# Altium project PCB_Project.PrjPcb
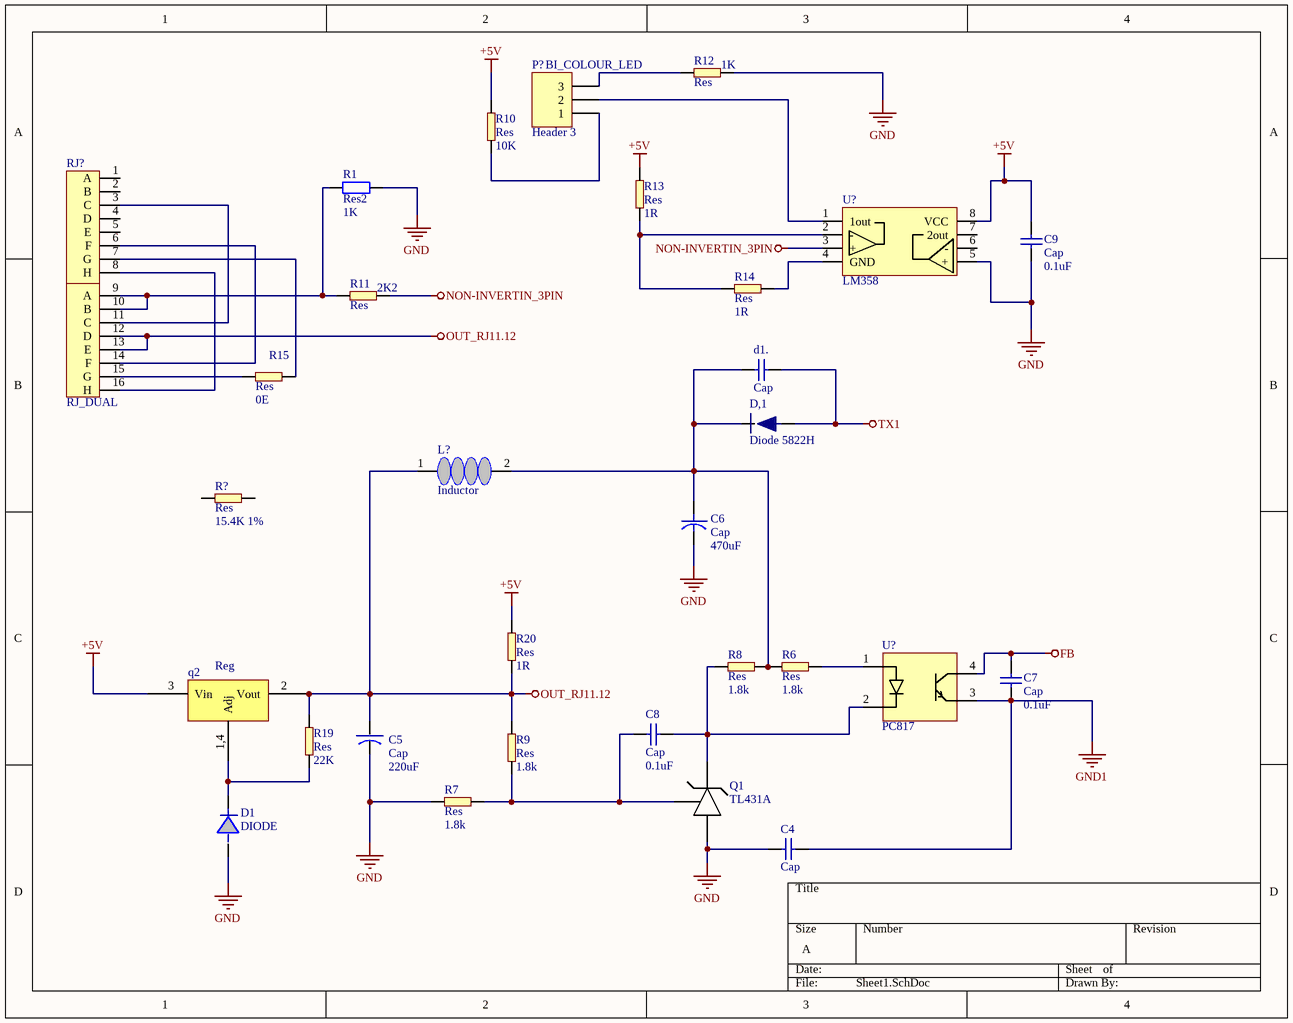
[diagram p0: Sheet1.SchDoc]
2 sheets, 49 parts. Net scope: global (net labels, ports and power ports of the same name join across sheets).
Board file: PCB1.PcbDoc
Sheets:
  Sheet1.SchDoc
  Sheet2.SchDoc

## Sheet Sheet1.SchDoc
size A

### Parts
(Parts that share a designator on the sheet are numbered #1, #2 ... from top to bottom, then left to right.)
C4  Cap  [CAP_P]
C5  Cap  [CAP_220uF]
C6  Cap  [CAP_470uF]
C7  Cap  [RES0805]
C8  Cap  [RES0805]
C9  Cap  [RES0805]
D1  DIODE  [SOD-80]
d1.  Cap  [CAP_P]
D,1  Diode 5822H  [Diode]
L?  Inductor  [Inductor]
P?  Header 3  [HDR1X3]
Q1  TL431A  [TL431A]
q2  Reg  [LM1117]
R1  Res2  value 1K  [AXIAL-0.4]
R6  Res  value 1.8k  [RES0805]
R7  Res  value 1.8k  [RES0805]
R8  Res  value 1.8k  [RES0805]
R9  Res  value 1.8k  [RES0805]
R10  Res  value 10K  [RES0805]
R11  Res  value 2K2  [RES0805]
R12  Res  value 1K  [RES0805]
R13  Res  value 1R  [RES0805]
R14  Res  value 1R  [RES0805]
R15  Res  value 0E  [RES0805]
R19  Res  value 22K  [RES0805]
R20  Res  value 1R  [RES0805]
R?  Res  value 15.4K 1%  [RES0805]
RJ?  RJ_DUAL  [RJ_Dual]
U?#1  LM358  [SOIC_8pin]
U?#2  PC817  [PC817]

### Nets
+5V: C9.2(A) q2.3(Vin) R10.1(a) R13.2(b) R20.1(a) U?#1.8(VCC)
FB: C7.1(A) U?#2.4(E)
GND: C4.2(A) C5.2(b) C6.2(b) C9.1(A) D1.1(A) Q1.2 R1.2 R7.2(b) R12.1(a) U?#1.5(+)
GND1: C4.1(A) C7.2(A) U?#2.3(D)
NON-INVERTIN_3PIN: R11.1(a) U?#1.3(+)
OUT_RJ11.12: C5.1(a) L?.1(a) q2.2(Vout) R9.1(a) R19.1(a) R20.2(b) RJ?.12(D) RJ?.13(E)
TX1: d1..1(A) D,1.1
NetC6_1: C6.1(A) d1..2(A) D,1.2 L?.2(b) R6.2(b) R8.1(a)
NetC8_1: C8.1(A) Q1.3 R8.2(b) U?#2.2(B)
NetC8_2: C8.2(A) Q1.1 R7.1(a) R9.2(b)
NetD1_2: D1.2(B) q2.1,4(Adj) R19.2(b)
NetP?_1: P?.1 R10.2(b)
NetP?_2: P?.2 U?#1.1(1out)
NetP?_3: P?.3 R12.2(b)
NetR1_1: R1.1 R11.2(b) RJ?.9(A) RJ?.10(B)
NetR6_1: R6.1(a) U?#2.1(A)
NetR13_1: R13.1(a) R14.2(b) U?#1.2(-)
NetR14_1: R14.1(a) U?#1.4(GND)
NetR15_1: R15.1(a) RJ?.15(G)
NetR15_2: R15.2(b) RJ?.7(G)
NetRJ?_3: RJ?.3(C) RJ?.11(C)
NetRJ?_6: RJ?.6(F) RJ?.14(F)
NetRJ?_8: RJ?.8(H) RJ?.16(H)

Not connected (* = marked no-connect by the designer): R? 1(a) 2(b); RJ? 1(A) 2(B) 4(D) 5(E); U?#1 6(-) 7(2out)

### Notes on the sheet
- (near P?) BI_COLOUR_LED
- (in symbol CAP_104_SMD) 0.1uF
- (in symbol CAP_220uF) 220uF
- (in symbol CAP_470uF) 470uF

### Library data of the parts
C4 d1. = Capacitor
C5 = CAP_220uF
C6 = CAP_470uF
C7-C9 = CAP_104_SMD
D1 = DIODE_4148: HIGH SPEED DIODE
L? = Inductor: Inductor for TSOP
P? = Header 3: Header, 3-Pin; LatestRevisionDate: 17-Jul-2002; LatestRevisionNote: Re-released for DXP Platform.; Publisher: Altium Limited
Q1 = TL431A_Adjustable Zener
q2 = LM1117
R1 = Res2: Resistor; Published: 8-Jun-2000; LatestRevisionDate: 17-Jul-2002; LatestRevisionNote: Re-released for DXP Platform.; PackageReference: AXIAL-0.4; Publisher: Altium Limited; PackageDescription: Axial Device, Thru-Hole; 2 Leads; 0.4 in Pin Spacing
R6-R15 R19 R20 R? = Resistor: Res0805
U?#1 = LM358: Dule op-Amp
U?#2 = PC817: Opto coupler

## Sheet Sheet2.SchDoc
size A
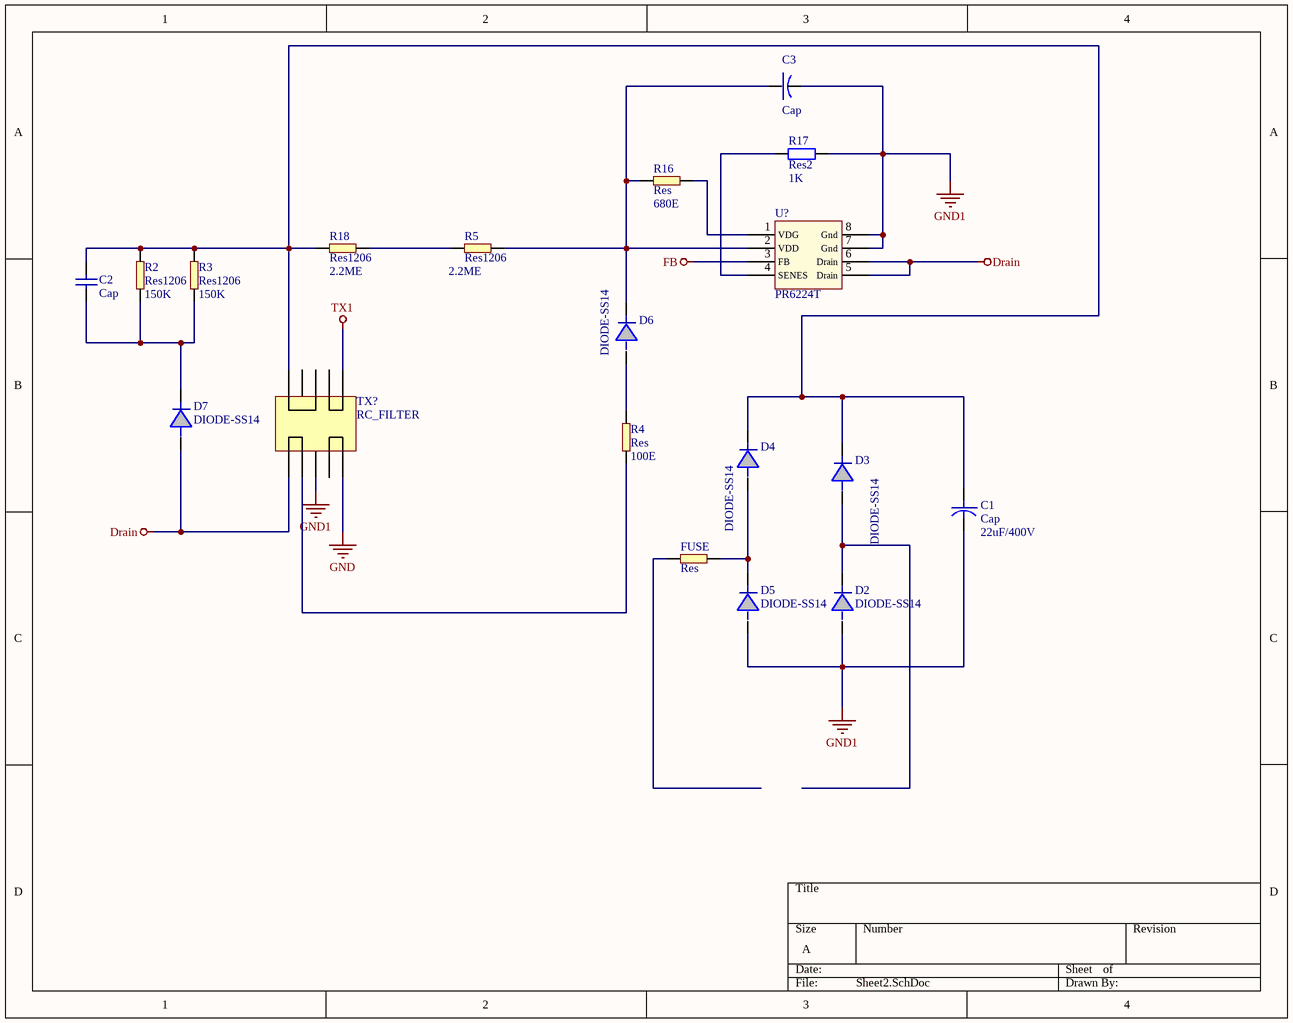
[diagram p1: Sheet2.SchDoc]

### Parts
(Parts that share a designator on the sheet are numbered #1, #2 ... from top to bottom, then left to right.)
C1  Cap  [CAP_470uF]
C2  Cap  [CAP_P]
C3  Cap  [Capacitor10UF/63V]
D2  DIODE-SS14  [DO-214AC]
D3  DIODE-SS14  [DO-214AC]
D4  DIODE-SS14  [DO-214AC]
D5  DIODE-SS14  [DO-214AC]
D6  DIODE-SS14  [DO-214AC]
D7  DIODE-SS14  [DO-214AC]
FUSE  Res  [Res_150mil]
R2  Res1206  value 150K  [1206]
R3  Res1206  value 150K  [1206]
R4  Res  value 100E  [RES0805]
R5  Res1206  value 2.2ME  [1206]
R16  Res  value 680E  [RES0805]
R17  Res2  value 1K  [AXIAL-0.4]
R18  Res1206  value 2.2ME  [1206]
TX?  RC_FILTER  [RC_FILTER]
U?#3  PR6224T  [PR6224T]

### Nets
Drain: D7.1(A) TX?.6 U?#3.5(Drain) U?#3.6(Drain)
FB: U?#3.3(FB)
GND: TX?.10
GND1: C1.2(b) C3.2(b) D2.1(A) D5.1(A) R17.2 TX?.8 U?#3.7(Gnd) U?#3.8(Gnd)
TX1: TX?.1
NetC1_1: C1.1(A) C2.2(A) D3.2(B) D4.2(B) R2.2(b) R3.2(b) R18.2(b) TX?.5
NetC2_1: C2.1(A) D7.2(B) R2.1(a) R3.1(a)
NetC3_1: C3.1(a) D6.2(B) R5.2(b) R16.1(a) U?#3.2(VDD)
NetD2_2: D2.2(B) D3.1(A)
NetD4_1: D4.1(A) D5.2(B) FUSE.1(a)
NetD6_1: D6.1(A) R4.2(b)
NetR4_1: R4.1(a) TX?.7
NetR5_1: R5.1(a) R18.1(a)
NetR16_2: R16.2(b) U?#3.1(VDG)
NetR17_1: R17.1 U?#3.4(SENES)

Not connected (* = marked no-connect by the designer): FUSE 2(b); TX? 2 3 4 9

### Notes on the sheet
- (in symbol CAP_470uF) 22uF/400V

### Library data of the parts
C1 = CAP_470uF
C2 = Capacitor
C3 = Cap-10uf/63V: Cap10uf/63V
D2-D7 = DIODE-SS14: SS14
FUSE = Res vertical placement
R4 R16 = Resistor: Res0805
R17 = Res2: Resistor; Published: 8-Jun-2000; LatestRevisionDate: 17-Jul-2002; LatestRevisionNote: Re-released for DXP Platform.; PackageReference: AXIAL-0.4; Publisher: Altium Limited; PackageDescription: Axial Device, Thru-Hole; 2 Leads; 0.4 in Pin Spacing
U?#3 = PR6224T: MOSFET

## Nets that join several sheets
FB: Sheet1 (C7.1 U?#2.4), Sheet2 (U?#3.3)
GND: Sheet1 (10 pins), Sheet2 (TX?.10)
GND1: Sheet1 (C4.1 C7.2 U?#2.3), Sheet2 (8 pins)
TX1: Sheet1 (d1..1 D,1.1), Sheet2 (TX?.1)